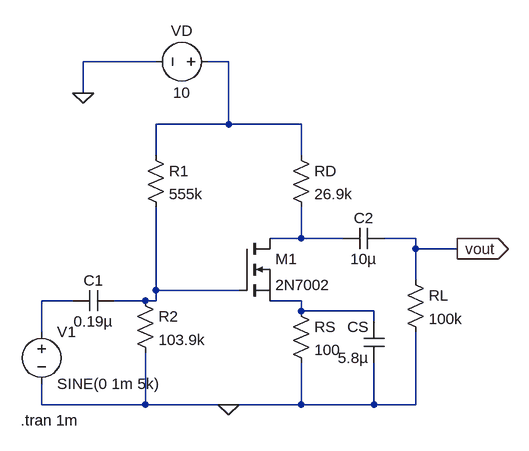
[diagram p0: schematic NNM24EE069_Nehalsm.asc]
NNM24EE069_Nehalsm.asc, the LTspice schematic file:
Version 4.1
SHEET 1 880 680
WIRE 32 -160 -80 -160
WIRE 144 -160 112 -160
WIRE -80 -112 -80 -160
WIRE 144 -64 144 -160
WIRE 144 -64 32 -64
WIRE 256 -64 144 -64
WIRE 32 -16 32 -64
WIRE 256 -16 256 -64
WIRE 256 112 256 64
WIRE 256 112 208 112
WIRE 320 112 256 112
WIRE 432 112 384 112
WIRE 432 128 432 112
WIRE 496 128 432 128
WIRE 432 176 432 128
WIRE 32 192 32 64
WIRE 160 192 32 192
WIRE -96 208 -144 208
WIRE 16 208 -32 208
WIRE 32 208 32 192
WIRE 32 208 16 208
WIRE 256 208 208 208
WIRE 256 224 256 208
WIRE 368 224 256 224
WIRE 368 240 368 224
WIRE -144 256 -144 208
WIRE -144 368 -144 336
WIRE 16 368 16 288
WIRE 16 368 -144 368
WIRE 144 368 16 368
WIRE 256 368 256 304
WIRE 256 368 144 368
WIRE 368 368 368 304
WIRE 368 368 256 368
WIRE 432 368 432 256
WIRE 432 368 368 368
FLAG 144 368 0
FLAG -80 -112 0
FLAG 496 128 vout
IOPIN 496 128 Out
SYMBOL res 16 -32 R0
SYMATTR InstName R1
SYMATTR Value 555k
SYMBOL res 0 192 R0
SYMATTR InstName R2
SYMATTR Value 103.9k
SYMBOL res 240 -32 R0
SYMATTR InstName RD
SYMATTR Value 26.9k
SYMBOL res 240 208 R0
SYMATTR InstName RS
SYMATTR Value 100
SYMBOL res 416 160 R0
SYMATTR InstName RL
SYMATTR Value 100k
SYMBOL cap -32 192 R90
WINDOW 0 0 32 VBottom 2
WINDOW 3 32 32 VTop 2
SYMATTR InstName C1
SYMATTR Value 0.19µ
SYMBOL cap 384 96 R90
WINDOW 0 0 32 VBottom 2
WINDOW 3 32 32 VTop 2
SYMATTR InstName C2
SYMATTR Value 10µ
SYMBOL cap 384 304 R180
WINDOW 0 24 56 Left 2
WINDOW 3 24 8 Left 2
SYMATTR InstName CS
SYMATTR Value 5.8µ
SYMBOL voltage -144 240 R0
WINDOW 123 0 0 Left 0
WINDOW 39 0 0 Left 0
SYMATTR InstName V1
SYMATTR Value SINE(0 1m 5k)
SYMBOL voltage 128 -160 R90
WINDOW 0 -32 56 VBottom 2
WINDOW 3 32 56 VTop 2
WINDOW 123 0 0 Left 0
WINDOW 39 0 0 Left 0
SYMATTR InstName VD
SYMATTR Value 10
SYMBOL nmos 160 112 R0
SYMATTR InstName M1
SYMATTR Value 2N7002
TEXT -176 392 Left 2 !.tran 1m

The netlist it stands for:
* NNM24EE069_Nehalsm.asc
R1 N001 N003 555k
R2 N003 0 103.9k
RD N001 N002 26.9k
RS N005 0 100
RL vout 0 100k
C1 N003 N004 0.19µ
C2 vout N002 10µ
CS 0 N005 5.8µ
V1 N004 0 SINE(0 1m 5k)
VD N001 0 10
M1 N002 N003 N005 N005 2N7002
.model NMOS NMOS
.model PMOS PMOS
.lib standard.mos
.tran 1m
.backanno
.end